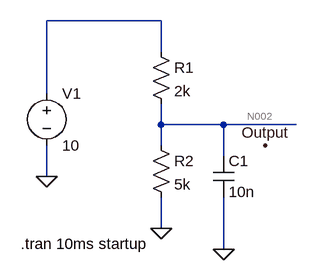
[diagram p0: schematic Prj1.asc]
Prj1.asc, the LTspice schematic file:
Version 4.1
SHEET 1 880 680
WIRE 224 16 48 16
WIRE 224 64 224 16
WIRE 48 128 48 16
WIRE 224 176 224 144
WIRE 320 176 224 176
WIRE 432 176 320 176
WIRE 224 208 224 176
WIRE 320 224 320 176
WIRE 48 256 48 208
WIRE 224 336 224 288
WIRE 320 368 320 288
FLAG 48 256 0
FLAG 224 336 0
FLAG 384 208 Output
FLAG 320 368 0
SYMBOL res 208 48 R0
SYMATTR InstName R1
SYMATTR Value 2k
SYMBOL res 208 192 R0
SYMATTR InstName R2
SYMATTR Value 5k
SYMBOL voltage 48 112 R0
WINDOW 123 0 0 Left 0
WINDOW 39 0 0 Left 0
SYMATTR InstName V1
SYMATTR Value 10
SYMBOL cap 304 224 R0
SYMATTR InstName C1
SYMATTR Value 10n
TEXT 8 360 Left 2 !.tran 10ms startup

The netlist it stands for:
* Prj1.asc
R1 N001 N002 2k
R2 N002 0 5k
V1 N001 0 10
C1 N002 0 10n
.tran 10ms startup
.backanno
.end

* Results of the author's LTspice run, read from the files saved beside the schematic
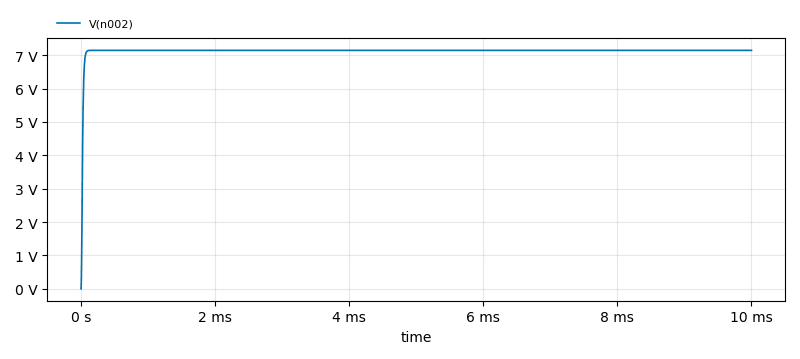
[diagram p1: Transient Analysis of Prj1.asc, plotted from the saved traces]
* Transient Analysis, 1 run:
*   V(n002): min 0 V, max 7.143 V, average 7.126 V, rms 7.131 V, last 7.143 V